# Altium schematic sheet Display.SchDoc: Display
size A4; DrawnBy: Loic Schillings; Revision: 1; SheetNumber: 2; SheetTotal: 5
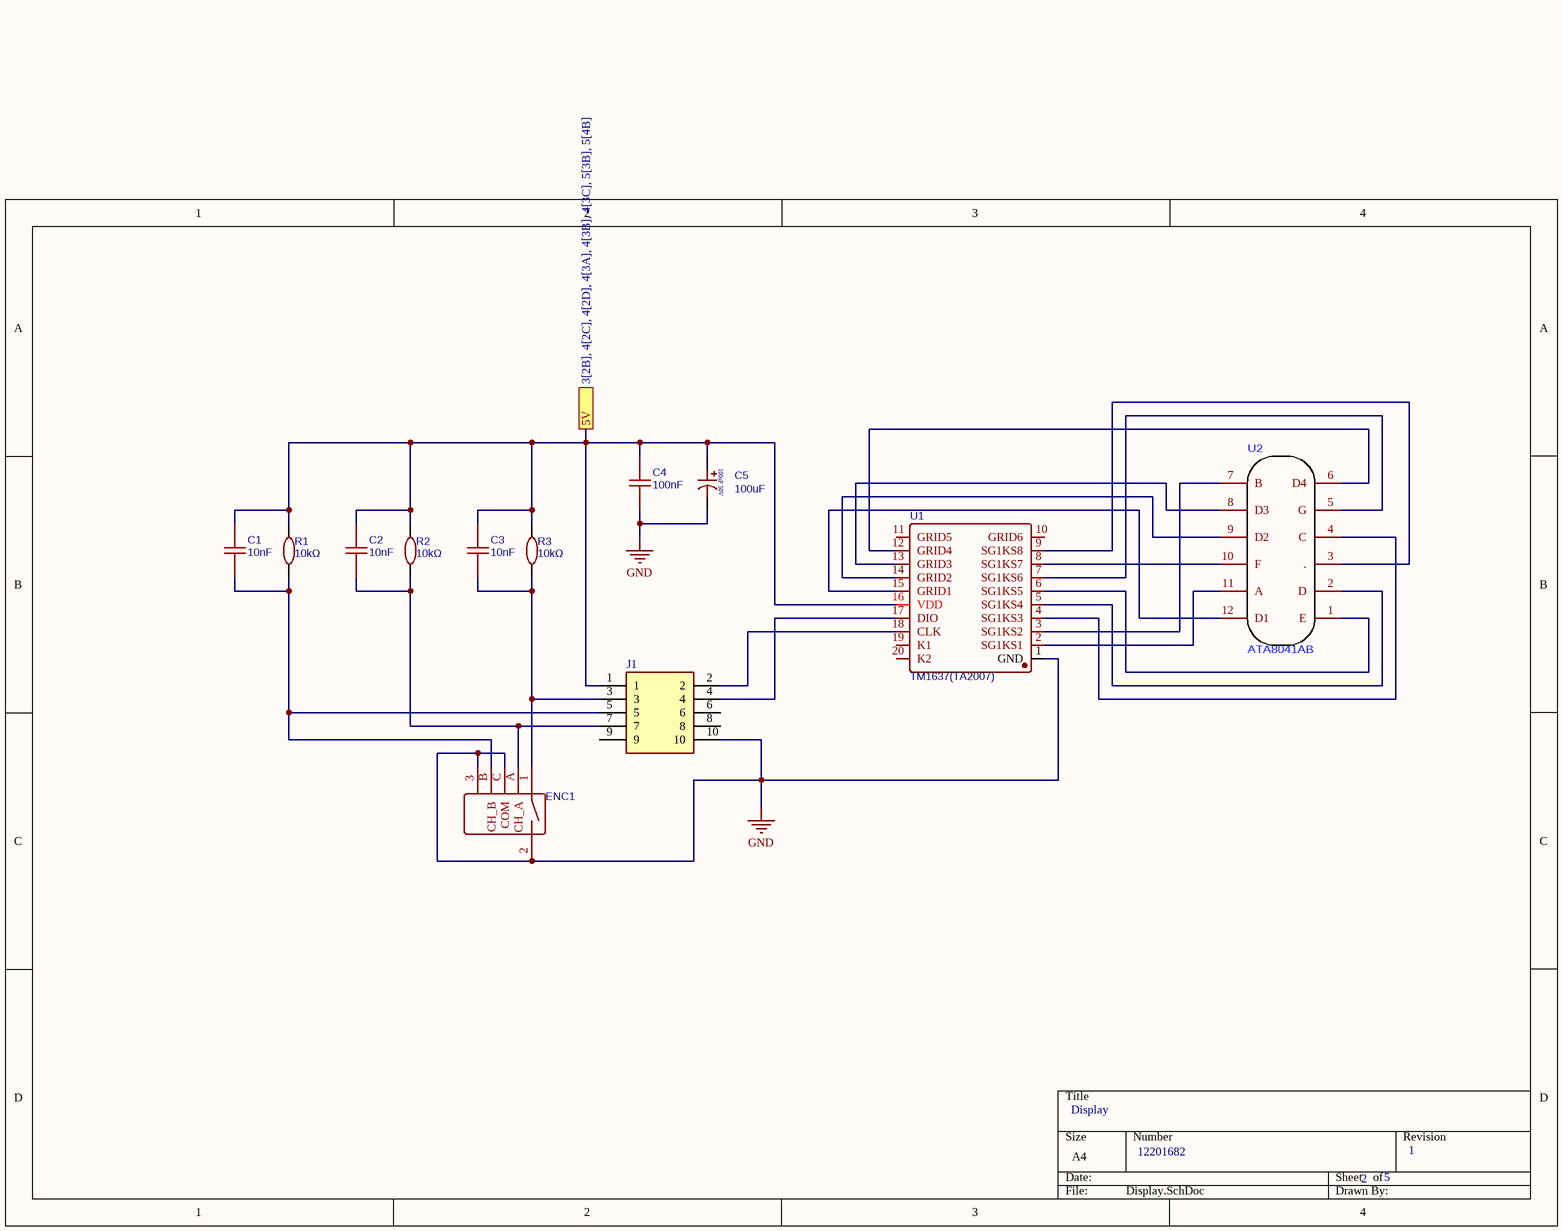
[diagram p0: Display.SchDoc]

## Parts
C1  10nF  [10nF]
C2  10nF  [10nf]
C3  10nF  [10nf]
C4  100nF  [10nf]
C5  100uF  [100uF 50V]
ENC1  PEC11R-4220F-S0012  [PEC11R-4220F-S0012]  (value not drawn)
J1  5104338-1  [10 Pin Boxheader]  (value not drawn)
R1  10kΩ  [R0805]
R2  10kΩ  [R0805]
R3  10kΩ  [R0805]
U1  TM1637(TA2007)  [TM1637(TA2007)]
U2  ATA8041AB  [ATA8041AB FOOTPRINT]

## Ports
5V (see 3[2B], 4[2C], 4[2D], 4[3A], 4[3B], 4[3C], 5[3B], 5[4B])

## Nets
GND: C4.1 C5.2 ENC1.2 ENC1.3 ENC1.C(COM) J1.10 U1.1(GND)
5V: C1.2 C2.2 C3.2 C4.2 C5.1 J1.1 R1.2 R2.2 R3.2 U1.16(VDD) ; port 5V
NetC1_1: C1.1 ENC1.B(CH_B) J1.5 R1.1
NetC2_1: C2.1 ENC1.A(CH_A) J1.7 R2.1
NetC3_1: C3.1 ENC1.1 J1.3 R3.1
NetJ1_2: J1.2 U1.18(CLK)
NetJ1_4: J1.4 U1.17(DIO)
NetU1_2: U1.2(SG1KS1) U2.11(A)
NetU1_3: U1.3(SG1KS2) U2.7(B)
NetU1_4: U1.4(SG1KS3) U2.4(C)
NetU1_5: U1.5(SG1KS4) U2.2(D)
NetU1_6: U1.6(SG1KS5) U2.1(E)
NetU1_7: U1.7(SG1KS6) U2.5(G)
NetU1_8: U1.8(SG1KS7) U2.10(F)
NetU1_9: U1.9(SG1KS8) U2.3(.)
NetU1_12: U1.12(GRID4) U2.6(D4)
NetU1_13: U1.13(GRID3) U2.8(D3)
NetU1_14: U1.14(GRID2) U2.9(D2)
NetU1_15: U1.15(GRID1) U2.12(D1)

Not connected (* = marked no-connect by the designer): J1 6 8 9; U1 10(GRID6) 11(GRID5) 19(K1) 20(K2)

## Notes on the sheet
- 12201682
- (in symbol 100uF_50V) 100uF 50V

## Library data of the parts
C1-C4 = 10nF: BOM_Manufacturer: CCTC(三环); BOM_Manufacturer Part: TCC0805X7R103M500DT; nameAlias: Capacitance; Contributor: LCSC; BOM_Supplier: LCSC; BOM_Supplier Part: C376921; BOM_JLCPCB Part Class: Extended Part; spicePre: C; spiceSymbolName: TCC0805X7R103M500DT
C5 = 100uF_50V: BOM_Manufacturer: Nichicon(尼吉康); BOM_Manufacturer Part: UWT1H101MNL1GS; Contributor: LCSC; nameAlias: Capacitance; BOM_Supplier: LCSC; BOM_Supplier Part: C445063; BOM_JLCPCB Part Class: Extended Part; spicePre: C; spiceSymbolName: UWT1H101MNL1GS
ENC1 = PEC11R-4220F-S0012: BOM_Manufacturer: BOURNS; Contributor: LCSC; BOM_Supplier: LCSC; BOM_Manufacturer Part: PEC11R-4220F-S0012; BOM_Supplier Part: C143817; BOM_JLCPCB Part Class: Extended Part; spicePre: S; spiceSymbolName: PEC11R-4220F-S0012
J1 = 10 Pin Boxheader: Header vert 10 way 2.54mm AmpLatch; Manufacturer_Name: TE Connectivity; Geometry.Height: 9.855mm; Mouser Part Number: 571-5104338-1; Mouser Price/Stock: https://www.mouser.co.uk/ProductDetail/TE-Connectivity/5104338-1?qs=84A%2FDAdkstJBRnv2z9usOA%3D%3D; Manufacturer_Part_Number: 5104338-1; Datasheet Link: https://www.te.com/commerce/DocumentDelivery/DDEController?Action=showdoc&DocId=Customer+Drawing%7F5104338%7FE%7Fpdf%7FEnglish%7FENG_CD_5104338_E.pdf%7F5104338-1
R1-R3 = 10kΩ: BOM_Manufacturer: UNI-ROYAL(厚声); BOM_Manufacturer Part: 0805W8F1002T5E; nameAlias: Resistance; Resistance (Ohms): 10K; BOM_Supplier: LCSC; BOM_Supplier Part: C17414; BOM_JLCPCB Part Class: Basic Part; spicePre: R; spiceSymbolName: 0805W8F1002T5E
U1 = TM1637(TA2007): BOM_Manufacturer: TM(天微); Contributor: lcsc; BOM_Supplier: LCSC; BOM_Supplier Part: C5337160; BOM_Manufacturer Part: TM1637(TA2007); BOM_JLCPCB Part Class: Extended Part; spicePre: U; spiceSymbolName: TM1637(TA2007)